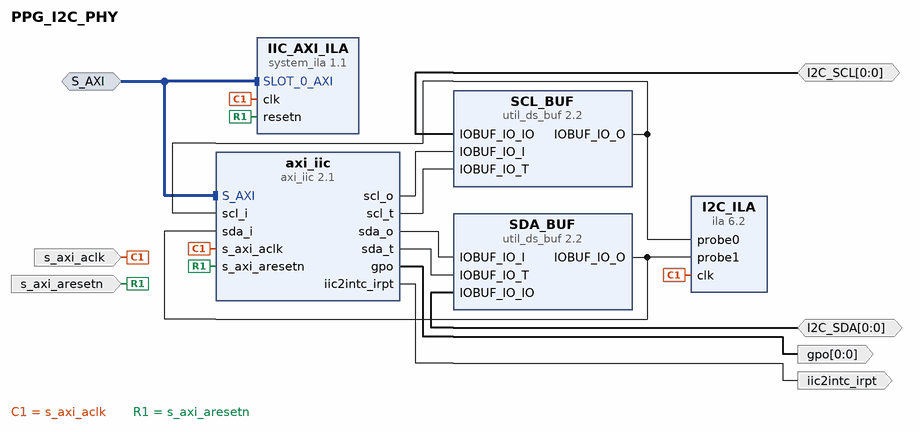
[diagram p0: block diagram of the top level]
# Vivado block design PPG_I2C_PHY, xczu9eg-ffvb1156-2-i, Vivado 2024.2.2
create_bd_design PPG_I2C_PHY

create_bd_intf_port -mode Slave -vlnv xilinx.com:interface:aximm_rtl:1.0 S_AXI
set_property -dict [list \
  CONFIG.ADDR_WIDTH 16 \
  CONFIG.ARUSER_WIDTH 0 \
  CONFIG.AWUSER_WIDTH 0 \
  CONFIG.BUSER_WIDTH 0 \
  CONFIG.DATA_WIDTH 32 \
  CONFIG.FREQ_HZ 200000000 \
  CONFIG.HAS_BRESP 1 \
  CONFIG.HAS_BURST 0 \
  CONFIG.HAS_CACHE 0 \
  CONFIG.HAS_LOCK 0 \
  CONFIG.HAS_PROT 0 \
  CONFIG.HAS_QOS 0 \
  CONFIG.HAS_REGION 0 \
  CONFIG.HAS_RRESP 1 \
  CONFIG.HAS_WSTRB 1 \
  CONFIG.ID_WIDTH 0 \
  CONFIG.NUM_READ_OUTSTANDING 1 \
  CONFIG.NUM_READ_THREADS 1 \
  CONFIG.NUM_WRITE_OUTSTANDING 1 \
  CONFIG.NUM_WRITE_THREADS 1 \
  CONFIG.PROTOCOL AXI4LITE \
  CONFIG.READ_WRITE_MODE READ_WRITE \
  CONFIG.RUSER_BITS_PER_BYTE 0 \
  CONFIG.RUSER_WIDTH 0 \
  CONFIG.WUSER_BITS_PER_BYTE 0 \
  CONFIG.WUSER_WIDTH 0 \
] [get_bd_intf_ports S_AXI]
create_bd_port -dir I -type clk s_axi_aclk
set_property -dict {CONFIG.ASSOCIATED_RESET s_axi_aresetn CONFIG.FREQ_HZ 200000000} [get_bd_ports s_axi_aclk]
create_bd_port -dir I -type rst s_axi_aresetn
create_bd_port -dir IO -from 0 -to 0 I2C_SCL
create_bd_port -dir IO -from 0 -to 0 I2C_SDA
create_bd_port -dir O -type intr iic2intc_irpt
create_bd_port -dir O -from 0 -to 0 gpo

create_bd_cell -type ip -vlnv xilinx.com:ip:axi_iic:2.1 axi_iic
create_bd_cell -type ip -vlnv xilinx.com:ip:util_ds_buf:2.2 SCL_BUF
set_property -dict {CONFIG.C_BUF_TYPE IOBUF} [get_bd_cells SCL_BUF]
create_bd_cell -type ip -vlnv xilinx.com:ip:util_ds_buf:2.2 SDA_BUF
set_property -dict {CONFIG.C_BUF_TYPE IOBUF} [get_bd_cells SDA_BUF]
create_bd_cell -type ip -vlnv xilinx.com:ip:ila:6.2 I2C_ILA
set_property -dict {CONFIG.C_MONITOR_TYPE Native CONFIG.C_NUM_OF_PROBES 2} [get_bd_cells I2C_ILA]
create_bd_cell -type ip -vlnv xilinx.com:ip:system_ila:1.1 IIC_AXI_ILA

# ---- connections ----

connect_bd_intf_net -intf_net S_AXI_0_1 [get_bd_intf_ports S_AXI] [get_bd_intf_pins axi_iic/S_AXI]
connect_bd_intf_net [get_bd_intf_ports S_AXI] [get_bd_intf_pins IIC_AXI_ILA/SLOT_0_AXI]
connect_bd_net [get_bd_ports I2C_SCL] [get_bd_pins SCL_BUF/IOBUF_IO_IO]
connect_bd_net [get_bd_ports I2C_SDA] [get_bd_pins SDA_BUF/IOBUF_IO_IO]
connect_bd_net -net SCL [get_bd_pins SCL_BUF/IOBUF_IO_O] [get_bd_pins axi_iic/scl_i] [get_bd_pins I2C_ILA/probe0]
connect_bd_net -net SDA [get_bd_pins SDA_BUF/IOBUF_IO_O] [get_bd_pins axi_iic/sda_i] [get_bd_pins I2C_ILA/probe1]
connect_bd_net [get_bd_pins axi_iic/gpo] [get_bd_ports gpo]
connect_bd_net [get_bd_pins axi_iic/iic2intc_irpt] [get_bd_ports iic2intc_irpt]
connect_bd_net [get_bd_pins axi_iic/scl_o] [get_bd_pins SCL_BUF/IOBUF_IO_I]
connect_bd_net [get_bd_pins axi_iic/scl_t] [get_bd_pins SCL_BUF/IOBUF_IO_T]
connect_bd_net [get_bd_pins axi_iic/sda_o] [get_bd_pins SDA_BUF/IOBUF_IO_I]
connect_bd_net [get_bd_pins axi_iic/sda_t] [get_bd_pins SDA_BUF/IOBUF_IO_T]
connect_bd_net -net s_axi_aclk_0_1 [get_bd_ports s_axi_aclk] [get_bd_pins axi_iic/s_axi_aclk] [get_bd_pins I2C_ILA/clk] [get_bd_pins IIC_AXI_ILA/clk]
connect_bd_net -net s_axi_aresetn_0_1 [get_bd_ports s_axi_aresetn] [get_bd_pins axi_iic/s_axi_aresetn] [get_bd_pins IIC_AXI_ILA/resetn]

# ---- address map ----
assign_bd_address -offset 0x0000 -range 4K -target_address_space [get_bd_addr_spaces S_AXI] [get_bd_addr_segs axi_iic/S_AXI/Reg]

validate_bd_design
save_bd_design
